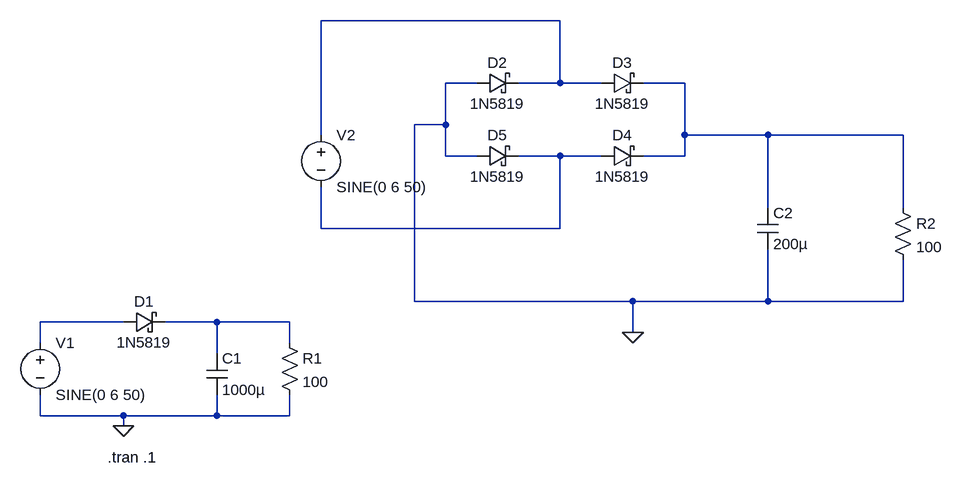
[diagram p0: schematic Rectifier1.asc]
Rectifier1.asc, the LTspice schematic file:
Version 4
SHEET 1 880 680
WIRE 208 -240 -160 -240
WIRE 80 -144 32 -144
WIRE 208 -144 208 -240
WIRE 208 -144 144 -144
WIRE 272 -144 208 -144
WIRE 400 -144 336 -144
WIRE 32 -80 32 -144
WIRE 32 -80 -16 -80
WIRE -160 -64 -160 -240
WIRE 400 -64 400 -144
WIRE 528 -64 400 -64
WIRE 736 -64 528 -64
WIRE 32 -32 32 -80
WIRE 80 -32 32 -32
WIRE 208 -32 144 -32
WIRE 272 -32 208 -32
WIRE 400 -32 400 -64
WIRE 400 -32 336 -32
WIRE 528 48 528 -64
WIRE 736 48 736 -64
WIRE -160 80 -160 16
WIRE 208 80 208 -32
WIRE 208 80 -160 80
WIRE -16 192 -16 -80
WIRE 320 192 -16 192
WIRE 528 192 528 112
WIRE 528 192 320 192
WIRE 736 192 736 128
WIRE 736 192 528 192
WIRE -464 224 -592 224
WIRE -320 224 -400 224
WIRE -208 224 -320 224
WIRE 320 240 320 192
WIRE -592 256 -592 224
WIRE -208 256 -208 224
WIRE -320 272 -320 224
WIRE -592 368 -592 336
WIRE -464 368 -592 368
WIRE -320 368 -320 336
WIRE -320 368 -464 368
WIRE -208 368 -208 336
WIRE -208 368 -320 368
WIRE -464 384 -464 368
FLAG -464 384 0
FLAG 320 240 0
SYMBOL voltage -592 240 R0
WINDOW 123 0 0 Left 0
WINDOW 39 0 0 Left 0
SYMATTR InstName V1
SYMATTR Value SINE(0 6 50)
SYMBOL schottky -464 240 R270
WINDOW 0 32 32 VTop 2
WINDOW 3 0 32 VBottom 2
SYMATTR InstName D1
SYMATTR Value 1N5819
SYMATTR Description Diode
SYMATTR Type diode
SYMBOL cap -336 272 R0
SYMATTR InstName C1
SYMATTR Value 1000µ
SYMBOL res -224 240 R0
SYMATTR InstName R1
SYMATTR Value 100
SYMBOL schottky 80 -128 R270
WINDOW 0 32 32 VTop 2
WINDOW 3 0 32 VBottom 2
SYMATTR InstName D2
SYMATTR Value 1N5819
SYMATTR Description Diode
SYMATTR Type diode
SYMBOL schottky 272 -128 R270
WINDOW 0 32 32 VTop 2
WINDOW 3 0 32 VBottom 2
SYMATTR InstName D3
SYMATTR Value 1N5819
SYMATTR Description Diode
SYMATTR Type diode
SYMBOL schottky 272 -16 R270
WINDOW 0 32 32 VTop 2
WINDOW 3 0 32 VBottom 2
SYMATTR InstName D4
SYMATTR Value 1N5819
SYMATTR Description Diode
SYMATTR Type diode
SYMBOL schottky 80 -16 R270
WINDOW 0 32 32 VTop 2
WINDOW 3 0 32 VBottom 2
SYMATTR InstName D5
SYMATTR Value 1N5819
SYMATTR Description Diode
SYMATTR Type diode
SYMBOL voltage -160 -80 R0
WINDOW 123 0 0 Left 0
SYMATTR InstName V2
SYMATTR Value SINE(0 6 50)
SYMBOL cap 512 48 R0
SYMATTR InstName C2
SYMATTR Value 200µ
SYMBOL res 720 32 R0
SYMATTR InstName R2
SYMATTR Value 100
TEXT -488 432 Left 2 !.tran .1

The netlist it stands for:
* Rectifier1.asc
V1 N004 0 SINE(0 6 50)
D1 N004 N005 1N5819
C1 N005 0 1000µ
R1 N005 0 100
D2 0 N001 1N5819
D3 N001 N002 1N5819
D4 N003 N002 1N5819
D5 0 N003 1N5819
V2 N001 N003 SINE(0 6 50)
C2 N002 0 200µ
R2 N002 0 100
.model D D
.lib standard.dio
.tran .1
.backanno
.end